# Altium project BEE-1012 PAY-EXP_V110.PrjPcb (part 4 of 7)

## Sheet 11_MCU.SchDoc
size 420 x 297 mm; SheetNumber: 20; SheetTotal: 36
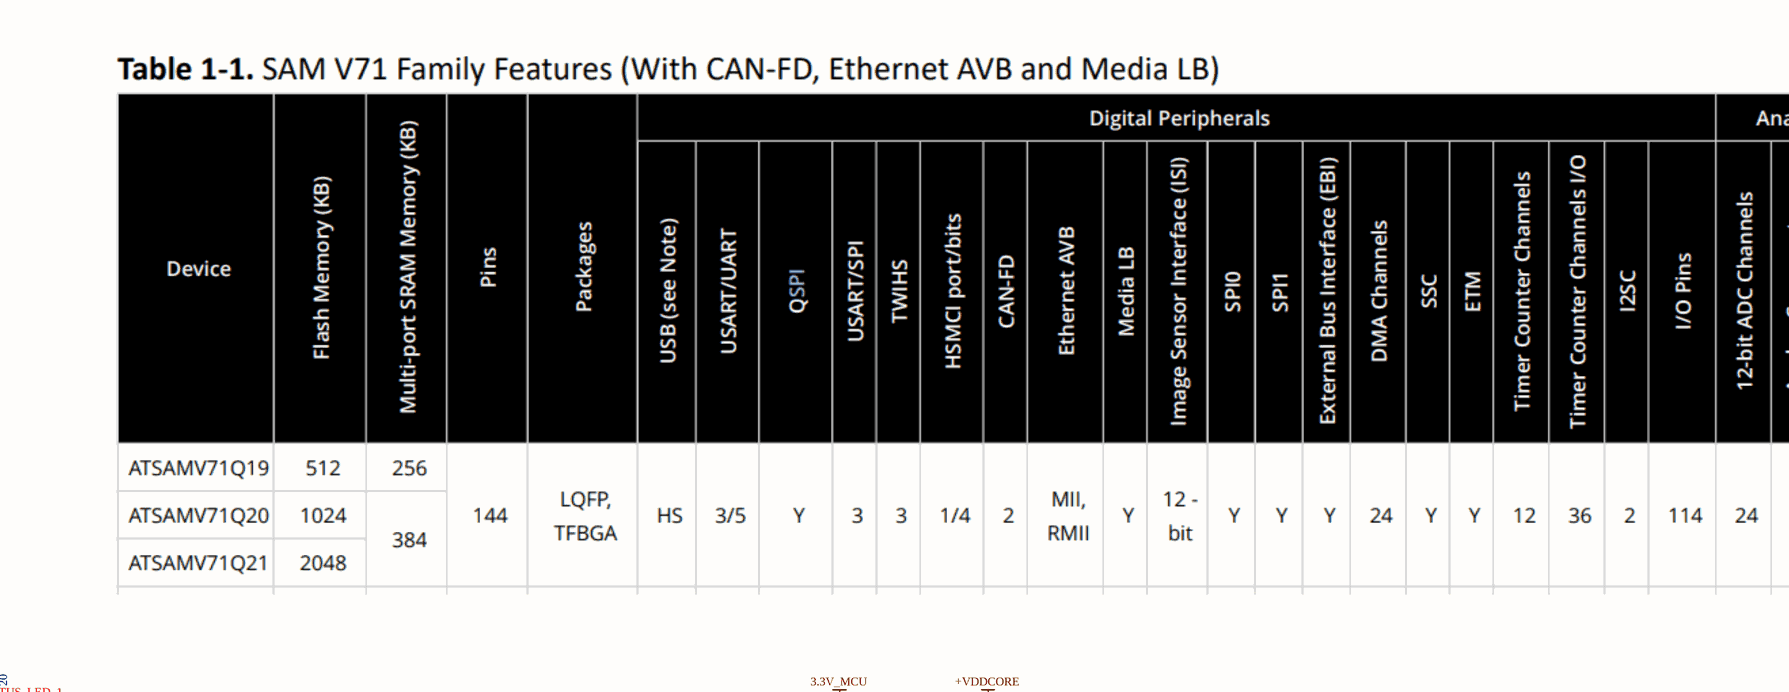
[diagram p18: 11_MCU.SchDoc, top left]
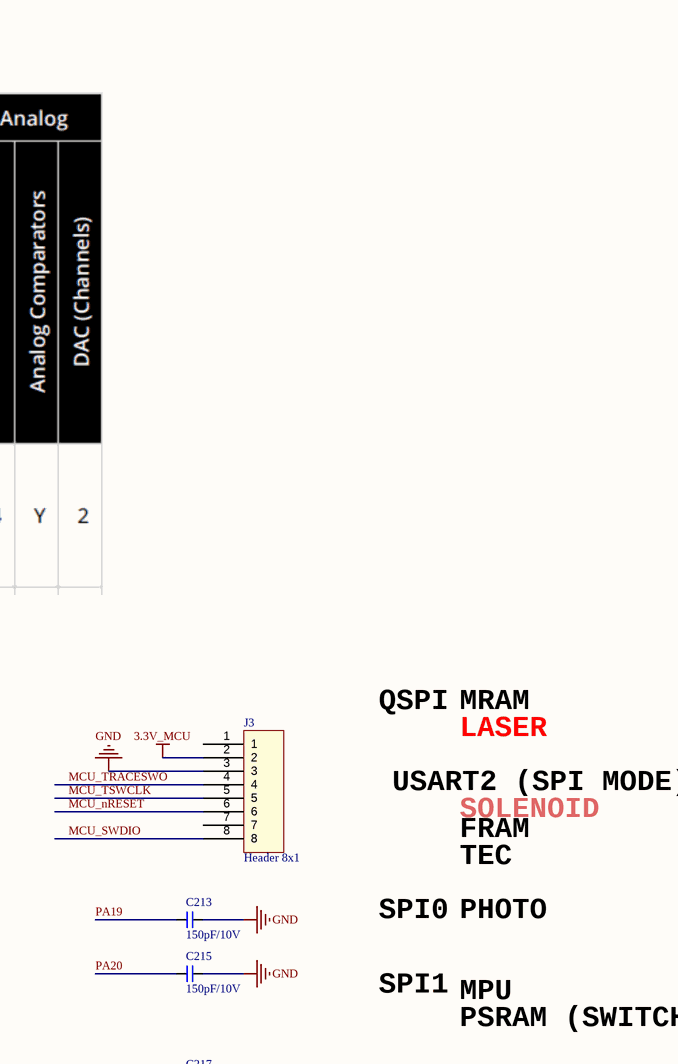
[diagram p19: 11_MCU.SchDoc, top right]
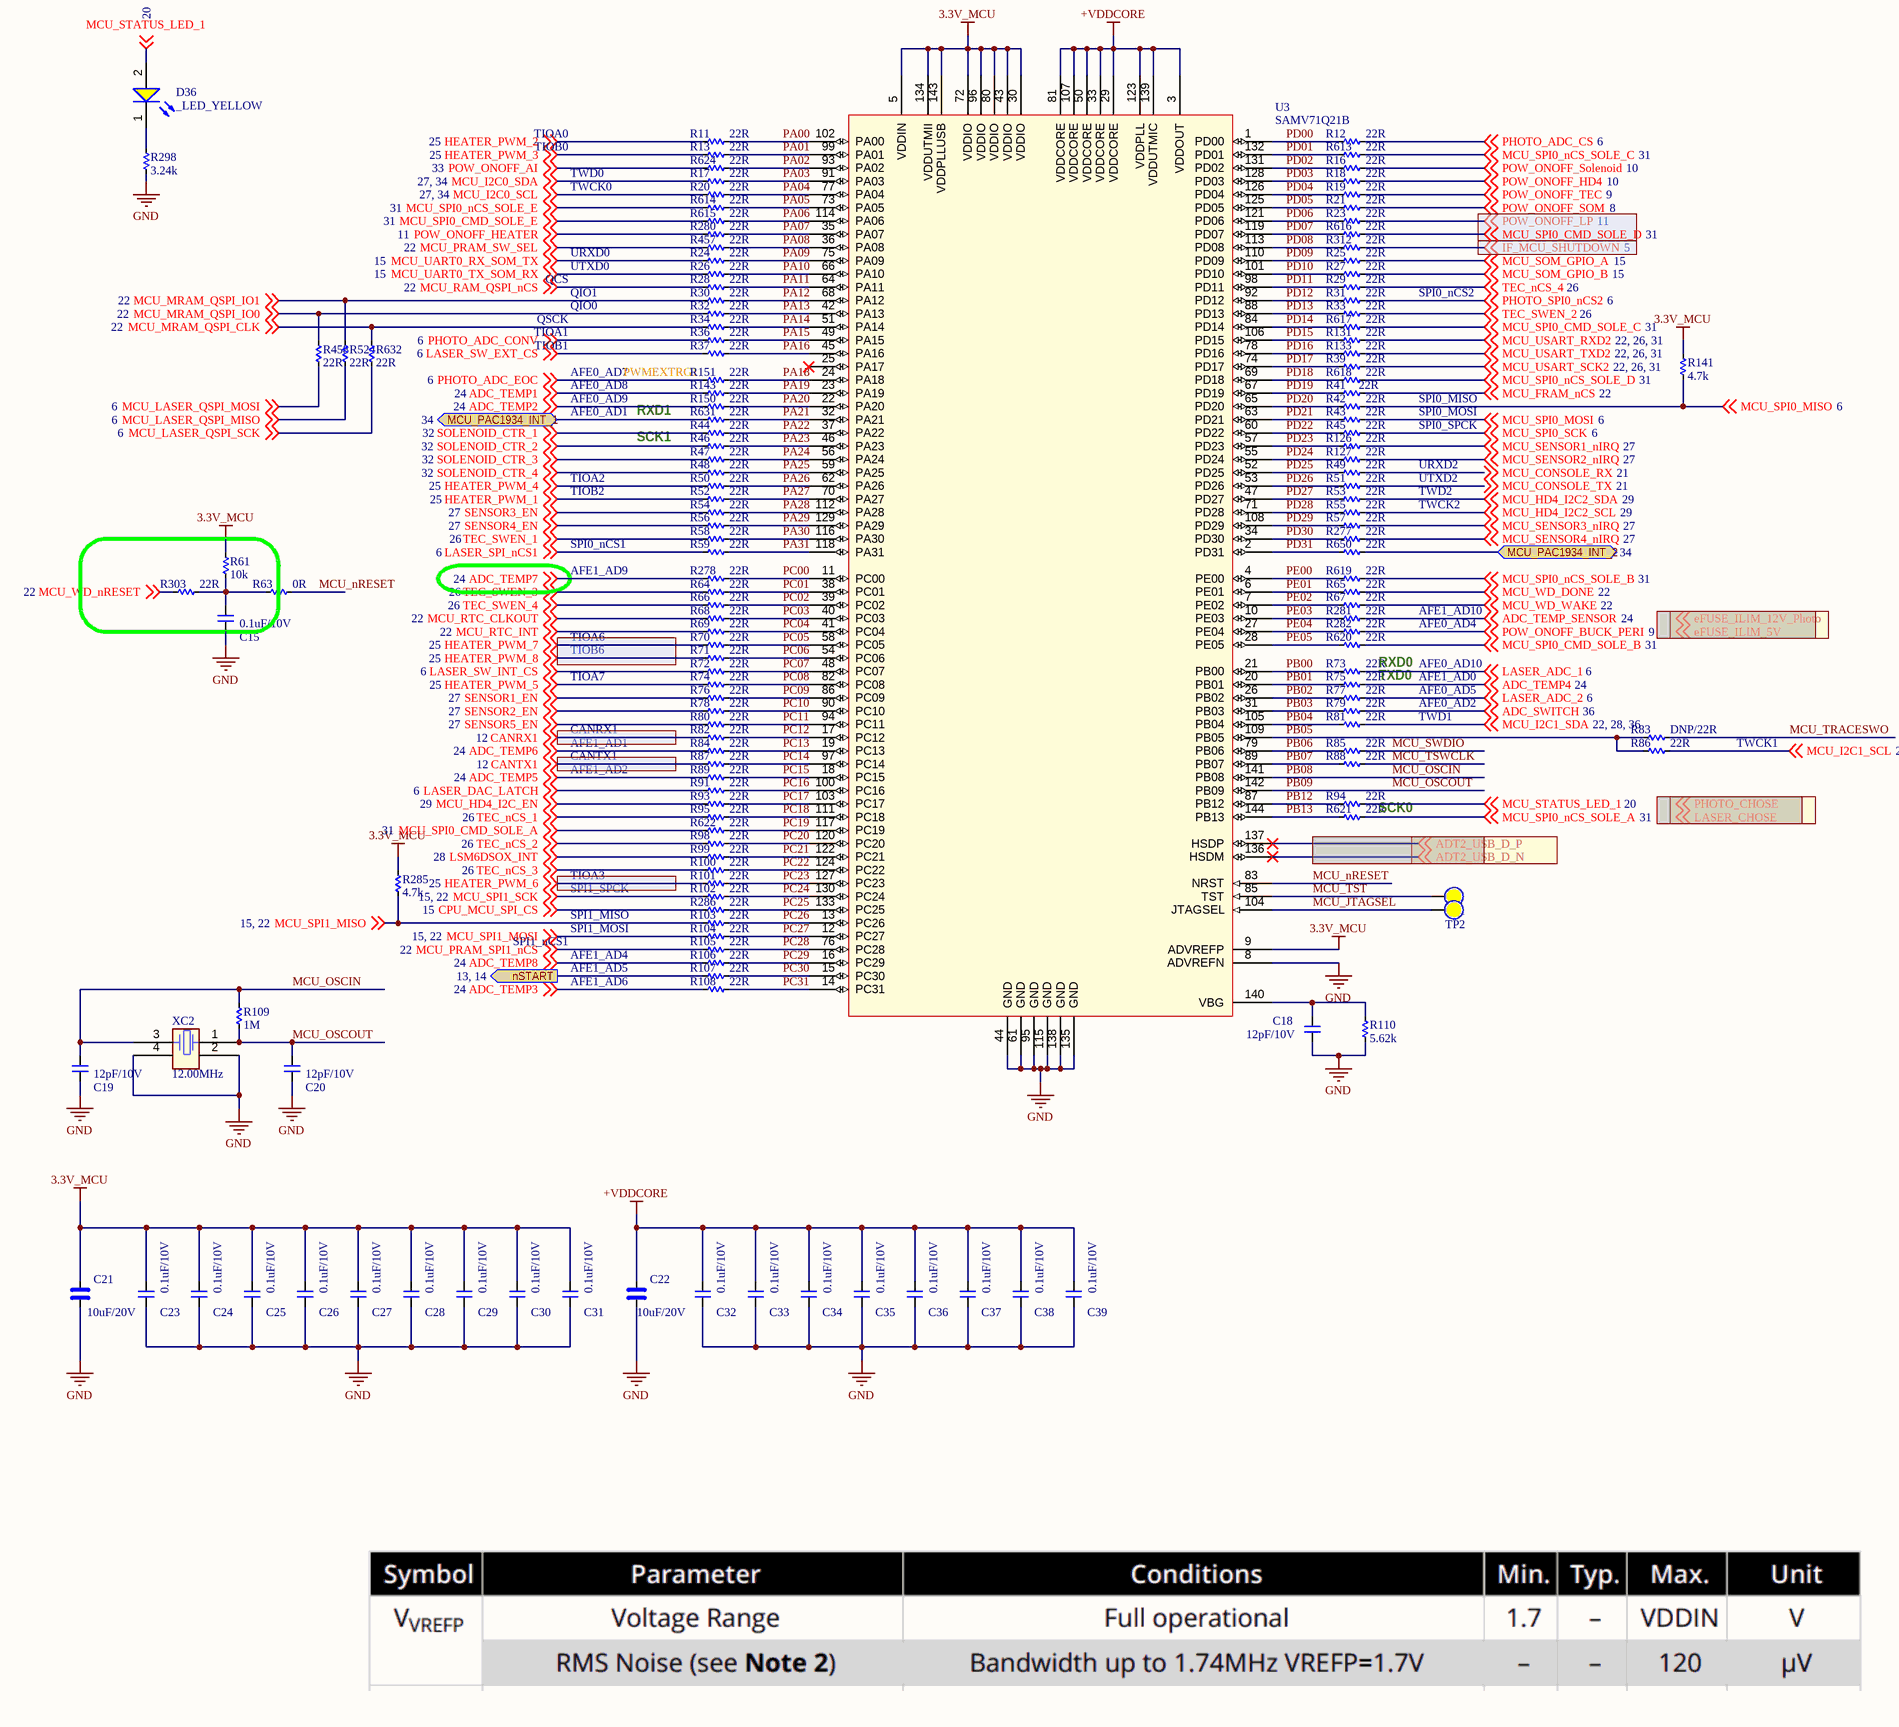
[diagram p20: 11_MCU.SchDoc, bottom left]
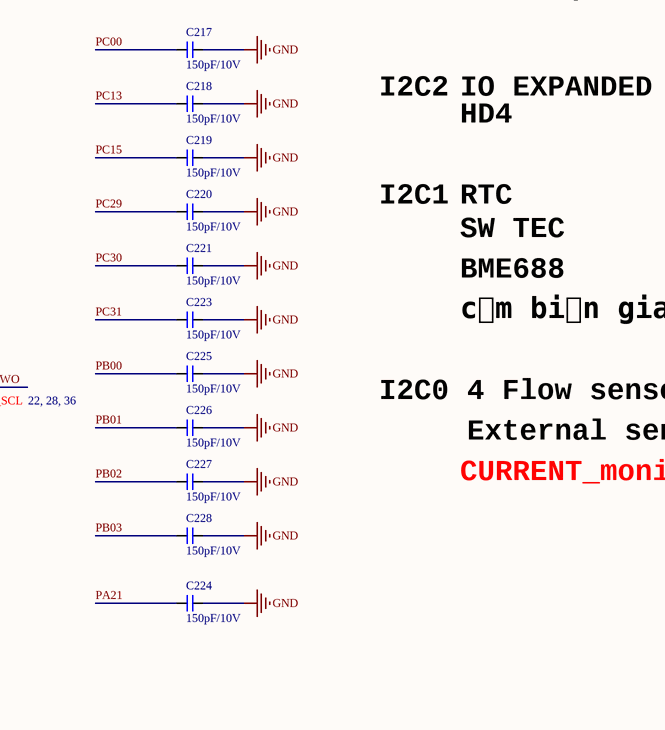
[diagram p21: 11_MCU.SchDoc, bottom right]

### Parts
C15  0.1uF/10V  [CAP_C_1005X60]
C18  12pF/10V  [CAP_C_1005X60]
C19  12pF/10V  [CAP_C_1005X60]
C20  12pF/10V  [CAP_C_1005X60]
C21  10uF/20V  [CAP_C_2012X110]
C22  10uF/20V  [CAP_C_2012X110]
C23  0.1uF/10V  [CAP_C_1005X60]
C24  0.1uF/10V  [CAP_C_1005X60]
C25  0.1uF/10V  [CAP_C_1005X60]
C26  0.1uF/10V  [CAP_C_1005X60]
C27  0.1uF/10V  [CAP_C_1005X60]
C28  0.1uF/10V  [CAP_C_1005X60]
C29  0.1uF/10V  [CAP_C_1005X60]
C30  0.1uF/10V  [CAP_C_1005X60]
C31  0.1uF/10V  [CAP_C_1005X60]
C32  0.1uF/10V  [CAP_C_1005X60]
C33  0.1uF/10V  [CAP_C_1005X60]
C34  0.1uF/10V  [CAP_C_1005X60]
C35  0.1uF/10V  [CAP_C_1005X60]
C36  0.1uF/10V  [CAP_C_1005X60]
C37  0.1uF/10V  [CAP_C_1005X60]
C38  0.1uF/10V  [CAP_C_1005X60]
C39  0.1uF/10V  [CAP_C_1005X60]
C213  150pF/10V  [CAP_C_1005X60]
C215  150pF/10V  [CAP_C_1005X60]
C217  150pF/10V  [CAP_C_1005X60]
C218  150pF/10V  [CAP_C_1005X60]
C219  150pF/10V  [CAP_C_1005X60]
C220  150pF/10V  [CAP_C_1005X60]
C221  150pF/10V  [CAP_C_1005X60]
C223  150pF/10V  [CAP_C_1005X60]
C224  150pF/10V  [CAP_C_1005X60]
C225  150pF/10V  [CAP_C_1005X60]
C226  150pF/10V  [CAP_C_1005X60]
C227  150pF/10V  [CAP_C_1005X60]
C228  150pF/10V  [CAP_C_1005X60]
D36  _LED_YELLOW  [LED_0603]
J3  Header 8x1  [Header_254P_8x1]
R11  22R  [RES_C_1005X40]
R12  22R  [RES_C_1005X40]
R13  22R  [RES_C_1005X40]
R16  22R  [RES_C_1005X40]
R17  22R  [RES_C_1005X40]
R18  22R  [RES_C_1005X40]
R19  22R  [RES_C_1005X40]
R20  22R  [RES_C_1005X40]
R21  22R  [RES_C_1005X40]
R23  22R  [RES_C_1005X40]
R24  22R  [RES_C_1005X40]
R25  22R  [RES_C_1005X40]
R26  22R  [RES_C_1005X40]
R27  22R  [RES_C_1005X40]
R28  22R  [RES_C_1005X40]
R29  22R  [RES_C_1005X40]
R30  22R  [RES_C_1005X40]
R31  22R  [RES_C_1005X40]
R32  22R  [RES_C_1005X40]
R33  22R  [RES_C_1005X40]
R34  22R  [RES_C_1005X40]
R36  22R  [RES_C_1005X40]
R37  22R  [RES_C_1005X40]
R39  22R  [RES_C_1005X40]
R41  22R  [RES_C_1005X40]
R42  22R  [RES_C_1005X40]
R43  22R  [RES_C_1005X40]
R44  22R  [RES_C_1005X40]
R45  22R  [RES_C_1005X40]
R46  22R  [RES_C_1005X40]
R47  22R  [RES_C_1005X40]
R48  22R  [RES_C_1005X40]
R49  22R  [RES_C_1005X40]
R50  22R  [RES_C_1005X40]
R51  22R  [RES_C_1005X40]
R52  22R  [RES_C_1005X40]
R53  22R  [RES_C_1005X40]
R54  22R  [RES_C_1005X40]
R55  22R  [RES_C_1005X40]
R56  22R  [RES_C_1005X40]
R57  22R  [RES_C_1005X40]
R58  22R  [RES_C_1005X40]
R59  22R  [RES_C_1005X40]
R61  10k  [RES_C_1005X40]
R63  0R  [RES_C_1005X40]
R64  22R  [RES_C_1005X40]
R65  22R  [RES_C_1005X40]
R66  22R  [RES_C_1005X40]
R67  22R  [RES_C_1005X40]
R68  22R  [RES_C_1005X40]
R69  22R  [RES_C_1005X40]
R70  22R  [RES_C_1005X40]
R71  22R  [RES_C_1005X40]
R72  22R  [RES_C_1005X40]
R73  22R  [RES_C_1005X40]
R74  22R  [RES_C_1005X40]
R75  22R  [RES_C_1005X40]
R76  22R  [RES_C_1005X40]
R77  22R  [RES_C_1005X40]
R78  22R  [RES_C_1005X40]
R79  22R  [RES_C_1005X40]
R80  22R  [RES_C_1005X40]
R81  22R  [RES_C_1005X40]
R82  22R  [RES_C_1005X40]
R83  DNP/22R  [RES_C_1005X40]
R84  22R  [RES_C_1005X40]
R85  22R  [RES_C_1005X40]
R86  22R  [RES_C_1005X40]
R87  22R  [RES_C_1005X40]
R88  22R  [RES_C_1005X40]
R89  22R  [RES_C_1005X40]
R91  22R  [RES_C_1005X40]
R93  22R  [RES_C_1005X40]
R94  22R  [RES_C_1005X40]
R95  22R  [RES_C_1005X40]
R98  22R  [RES_C_1005X40]
R99  22R  [RES_C_1005X40]
R100  22R  [RES_C_1005X40]
R101  22R  [RES_C_1005X40]
R102  22R  [RES_C_1005X40]
R103  22R  [RES_C_1005X40]
R104  22R  [RES_C_1005X40]
R105  22R  [RES_C_1005X40]
R106  22R  [RES_C_1005X40]
R107  22R  [RES_C_1005X40]
R108  22R  [RES_C_1005X40]
R109  1M  [RES_C_1005X40]
R110  5.62k  [RES_C_1005X40]
R126  22R  [RES_C_1005X40]
R127  22R  [RES_C_1005X40]
R131  22R  [RES_C_1005X40]
R133  22R  [RES_C_1005X40]
R141  4.7k  [RES_C_1005X40]
R143  22R  [RES_C_1005X40]
R150  22R  [RES_C_1005X40]
R151  22R  [RES_C_1005X40]
R277  22R  [RES_C_1005X40]
R278  22R  [RES_C_1005X40]
R280  22R  [RES_C_1005X40]
R281  22R  [RES_C_1005X40]
R282  22R  [RES_C_1005X40]
R285  4.7k  [RES_C_1005X40]
R286  22R  [RES_C_1005X40]
R298  3.24k  [RES_C_1005X40]
R303  22R  [RES_C_1005X40]
R312  22R  [RES_C_1005X40]
R457  22R  [RES_C_1005X40]
R458  22R  [RES_C_1005X40]
R524  22R  [RES_C_1005X40]
R613  22R  [RES_C_1005X40]
R614  22R  [RES_C_1005X40]
R615  22R  [RES_C_1005X40]
R616  22R  [RES_C_1005X40]
R617  22R  [RES_C_1005X40]
R618  22R  [RES_C_1005X40]
R619  22R  [RES_C_1005X40]
R620  22R  [RES_C_1005X40]
R621  22R  [RES_C_1005X40]
R622  22R  [RES_C_1005X40]
R624  22R  [RES_C_1005X40]
R631  22R  [RES_C_1005X40]
R632  22R  [RES_C_1005X40]
R650  22R  [RES_C_1005X40]
TP1  (no value)  [Testpoint_80]  (no BOM)
TP2  (no value)  [Testpoint_80]  (no BOM)
U3  SAMV71Q21B  [AP6-00118]
XC2  value 12.00MHz  [AP7-00039]  (hidden comment: FC5BQCCMC12.0-T1)

### Ports
MCU_PAC1934_INT_1 (bidir, see 34), MCU_PAC1934_INT_2 (bidir, see 34), nSTART (out, see 13, 14)

### Nets
3.3V_MCU: C21.1 C23.2 C24.2 C25.2 C26.2 C27.2 C28.2 C29.2 C30.2 C31.2 J3.2 R61.2 R141.1 R285.1 U3.5(VDDIN) U3.9(ADVREFP) U3.30(VDDIO) U3.43(VDDIO) U3.72(VDDIO) U3.80(VDDIO) U3.96(VDDIO) U3.134(VDDUTMII) U3.143(VDDPLLUSB)
+VDDCORE: C22.1 C32.2 C33.2 C34.2 C35.2 C36.2 C37.2 C38.2 C39.2 U3.3(VDDOUT) U3.29(VDDCORE) U3.33(VDDCORE) U3.50(VDDCORE) U3.81(VDDCORE) U3.107(VDDCORE) U3.123(VDDPLL) U3.139(VDDUTMIC)
GND: C15.1 C18.1 C19.1 C20.1 C21.2 C22.2 C23.1 C24.1 C25.1 C26.1 C27.1 C28.1 C29.1 C30.1 C31.1 C32.1 C33.1 C34.1 C35.1 C36.1 C37.1 C38.1 C39.1 C213.1 C215.1 C217.1 C218.1 C219.1 C220.1 C221.1 C223.1 C224.1 C225.1 C226.1 C227.1 C228.1 J3.3 R110.1 R298.2 U3.8(ADVREFN) U3.44(GND) U3.61(GND) U3.95(GND) U3.115(GND) U3.135(GND) U3.138(GND) XC2.2 XC2.4
ADC_SWITCH: R79.1 ; off-sheet ADC_SWITCH
ADC_TEMP1: R143.2 ; off-sheet ADC_TEMP1
ADC_TEMP2: R150.2 ; off-sheet ADC_TEMP2
ADC_TEMP3: R108.2 ; off-sheet ADC_TEMP3
ADC_TEMP4: R75.1 ; off-sheet ADC_TEMP4
ADC_TEMP5: R89.2 ; off-sheet ADC_TEMP5
ADC_TEMP6: R84.2 ; off-sheet ADC_TEMP6
ADC_TEMP7: R278.2 ; off-sheet ADC_TEMP7
ADC_TEMP8: R106.2 ; off-sheet ADC_TEMP8
ADC_TEMP_SENSOR: R281.1 ; off-sheet ADC_TEMP_SENSOR  [project net TEMP _SENSOR]
CANRX1: R82.2 ; off-sheet CANRX1
CANTX1: R87.2 ; off-sheet CANTX1
CPU_MCU_SPI_CS: R286.2 ; off-sheet CPU_MCU_SPI_CS
HEATER_PWM_1: R52.2 ; off-sheet HEATER_PWM_1
HEATER_PWM_2: R11.2 ; off-sheet HEATER_PWM_2
HEATER_PWM_3: R13.2 ; off-sheet HEATER_PWM_3
HEATER_PWM_4: R50.2 ; off-sheet HEATER_PWM_4
HEATER_PWM_5: R74.2 ; off-sheet HEATER_PWM_5
HEATER_PWM_6: R101.2 ; off-sheet HEATER_PWM_6
HEATER_PWM_7: R70.2 ; off-sheet HEATER_PWM_7
HEATER_PWM_8: R71.2 ; off-sheet HEATER_PWM_8
IF_MCU_SHUTDOWN: R312.1 ; off-sheet IF_MCU_SHUTDOWN
LASER_ADC_1: R73.1 ; off-sheet LASER_ADC_1
LASER_ADC_2: R77.1 ; off-sheet LASER_ADC_2
LASER_DAC_LATCH: R91.2 ; off-sheet LASER_DAC_LATCH
LASER_SPI_nCS1: R59.2 ; off-sheet LASER_SPI_nCS1
LASER_SW_EXT_CS: R37.2 ; off-sheet LASER_SW_EXT_CS
LASER_SW_INT_CS: R72.2 ; off-sheet LASER_SW_INT_CS
LSM6DSOX_INT: R99.2 ; off-sheet LSM6DSOX_INT
MCU_CONSOLE_RX: R49.1 ; off-sheet MCU_CONSOLE_RX
MCU_CONSOLE_TX: R51.1 ; off-sheet MCU_CONSOLE_TX
MCU_FRAM_nCS: R41.2 ; off-sheet MCU_FRAM_nCS
MCU_HD4_I2C2_SCL: R55.1 ; off-sheet MCU_HD4_I2C2_SCL
MCU_HD4_I2C2_SDA: R53.1 ; off-sheet MCU_HD4_I2C2_SDA
MCU_HD4_I2C_EN: R93.2 ; off-sheet MCU_HD4_I2C_EN
MCU_I2C0_SCL: R20.2 ; off-sheet MCU_I2C0_SCL
MCU_I2C0_SDA: R17.2 ; off-sheet MCU_I2C0_SDA
MCU_I2C1_SCL: R86.1 ; off-sheet MCU_I2C1_SCL
MCU_I2C1_SDA: R81.1 ; off-sheet MCU_I2C1_SDA
MCU_JTAGSEL: TP2.1 U3.104(JTAGSEL)
MCU_LASER_QSPI_MISO: R524.2 ; off-sheet MCU_LASER_QSPI_MISO
MCU_LASER_QSPI_MOSI: R458.2 ; off-sheet MCU_LASER_QSPI_MOSI
MCU_LASER_QSPI_SCK: R632.2 ; off-sheet MCU_LASER_QSPI_SCK
MCU_MRAM_QSPI_CLK: R34.2 R632.1 ; off-sheet MCU_MRAM_QSPI_CLK
MCU_MRAM_QSPI_IO0: R32.2 R458.1 ; off-sheet MCU_MRAM_QSPI_IO0
MCU_MRAM_QSPI_IO1: R30.2 R524.1 ; off-sheet MCU_MRAM_QSPI_IO1
MCU_nRESET: J3.6 R63.1 U3.83(NRST)
MCU_OSCIN: C19.2 R109.2 U3.141(PB08) XC2.3  [also labelled PB08]
MCU_OSCOUT: C20.2 R109.1 U3.142(PB09) XC2.1  [also labelled PB09]
MCU_PRAM_SPI1_nCS: R105.2 ; off-sheet MCU_PRAM_SPI1_nCS
MCU_PRAM_SW_SEL: R457.2 ; off-sheet MCU_PRAM_SW_SEL
MCU_RAM_QSPI_nCS: R28.2 ; off-sheet MCU_RAM_QSPI_nCS
MCU_RTC_CLKOUT: R68.2 ; off-sheet MCU_RTC_CLKOUT
MCU_RTC_INT: R69.2 ; off-sheet MCU_RTC_INT
MCU_SENSOR1_nIRQ: R126.1 ; off-sheet MCU_SENSOR1_nIRQ
MCU_SENSOR2_nIRQ: R127.1 ; off-sheet MCU_SENSOR2_nIRQ
MCU_SENSOR3_nIRQ: R57.2 ; off-sheet MCU_SENSOR3_nIRQ
MCU_SENSOR4_nIRQ: R277.2 ; off-sheet MCU_SENSOR4_nIRQ
MCU_SOM_GPIO_A: R25.1 ; off-sheet MCU_SOM_GPIO_A
MCU_SOM_GPIO_B: R27.1 ; off-sheet MCU_SOM_GPIO_B
MCU_SPI0_CMD_SOLE_A: R622.2 ; off-sheet MCU_SPI0_CMD_SOLE_A
MCU_SPI0_CMD_SOLE_B: R620.1 ; off-sheet MCU_SPI0_CMD_SOLE_B
MCU_SPI0_CMD_SOLE_C: R617.1 ; off-sheet MCU_SPI0_CMD_SOLE_C
MCU_SPI0_CMD_SOLE_D: R616.1 ; off-sheet MCU_SPI0_CMD_SOLE_D
MCU_SPI0_CMD_SOLE_E: R615.2 ; off-sheet MCU_SPI0_CMD_SOLE_E
MCU_SPI0_MISO: R42.1 R141.2 ; off-sheet MCU_SPI0_MISO
MCU_SPI0_MOSI: R43.1 ; off-sheet MCU_SPI0_MOSI
MCU_SPI0_nCS_SOLE_A: R621.1 ; off-sheet MCU_SPI0_nCS_SOLE_A
MCU_SPI0_nCS_SOLE_B: R619.1 ; off-sheet MCU_SPI0_nCS_SOLE_B
MCU_SPI0_nCS_SOLE_C: R613.1 ; off-sheet MCU_SPI0_nCS_SOLE_C
MCU_SPI0_nCS_SOLE_D: R618.1 ; off-sheet MCU_SPI0_nCS_SOLE_D
MCU_SPI0_nCS_SOLE_E: R614.2 ; off-sheet MCU_SPI0_nCS_SOLE_E
MCU_SPI0_SCK: R45.1 ; off-sheet MCU_SPI0_SCK
MCU_SPI1_MISO: R103.2 R285.2 ; off-sheet MCU_SPI1_MISO
MCU_SPI1_MOSI: R104.2 ; off-sheet MCU_SPI1_MOSI
MCU_SPI1_SCK: R102.2 ; off-sheet MCU_SPI1_SCK
MCU_STATUS_LED_1: D36.2(A) R94.1 ; off-sheet MCU_STATUS_LED_1
MCU_SWDIO: J3.8 R85.1
MCU_TRACESWO: J3.4 R83.1
MCU_TST: TP1.1 U3.85(TST)
MCU_TSWCLK: J3.5 R88.1
MCU_UART0_RX_SOM_TX: R24.2 ; off-sheet MCU_UART0_RX_SOM_TX
MCU_UART0_TX_SOM_RX: R26.2 ; off-sheet MCU_UART0_TX_SOM_RX
MCU_USART_RXD2: R131.1 ; off-sheet MCU_USART_RXD2
MCU_USART_SCK2: R39.1 ; off-sheet MCU_USART_SCK2
MCU_USART_TXD2: R133.1 ; off-sheet MCU_USART_TXD2
MCU_WD_DONE: R65.1 ; off-sheet MCU_WD_DONE
MCU_WD_nRESET: R303.2 ; off-sheet MCU_WD_nRESET
MCU_WD_WAKE: R67.1 ; off-sheet MCU_WD_WAKE
PA00: R11.1 U3.102(PA00)
PA01: R13.1 U3.99(PA01)
PA02: R624.1 U3.93(PA02)
PA03: R17.1 U3.91(PA03)
PA04: R20.1 U3.77(PA04)
PA05: R614.1 U3.73(PA05)
PA06: R615.1 U3.114(PA06)
PA07: R280.1 U3.35(PA07)
PA08: R457.1 U3.36(PA08)
PA09: R24.1 U3.75(PA09)
PA10: R26.1 U3.66(PA10)
PA11: R28.1 U3.64(PA11)
PA12: R30.1 U3.68(PA12)
PA13: R32.1 U3.42(PA13)
PA14: R34.1 U3.51(PA14)
PA15: R36.1 U3.49(PA15)
PA16: R37.1 U3.45(PA16)
PA18: R151.1 U3.24(PA18)
PA19: C213.2 R143.1 U3.23(PA19)
PA20: C215.2 R150.1 U3.22(PA20)
PA21: C224.2 R631.1 U3.32(PA21)
PA22: R44.1 U3.37(PA22)
PA23: R46.1 U3.46(PA23)
PA24: R47.1 U3.56(PA24)
PA25: R48.1 U3.59(PA25)
PA26: R50.1 U3.62(PA26)
PA27: R52.1 U3.70(PA27)
PA28: R54.1 U3.112(PA28)
PA29: R56.1 U3.129(PA29)
PA30: R58.1 U3.116(PA30)
PA31: R59.1 U3.118(PA31)
PB00: C225.2 R73.2 U3.21(PB00)
PB01: C226.2 R75.2 U3.20(PB01)
PB02: C227.2 R77.2 U3.26(PB02)
PB03: C228.2 R79.2 U3.31(PB03)
PB04: R81.2 U3.105(PB04)
PB05: R83.2 R86.2 U3.109(PB05)
PB06: R85.2 U3.79(PB06)
PB07: R88.2 U3.89(PB07)
PB12: R94.2 U3.87(PB12)
PB13: R621.2 U3.144(PB13)
PC00: C217.2 R278.1 U3.11(PC00)
PC01: R64.1 U3.38(PC01)
PC02: R66.1 U3.39(PC02)
PC03: R68.1 U3.40(PC03)
PC04: R69.1 U3.41(PC04)
PC05: R70.1 U3.58(PC05)
PC06: R71.1 U3.54(PC06)
PC07: R72.1 U3.48(PC07)
PC08: R74.1 U3.82(PC08)
PC09: R76.1 U3.86(PC09)
PC10: R78.1 U3.90(PC10)
PC11: R80.1 U3.94(PC11)
PC12: R82.1 U3.17(PC12)
PC13: C218.2 R84.1 U3.19(PC13)
PC14: R87.1 U3.97(PC14)
PC15: C219.2 R89.1 U3.18(PC15)
PC16: R91.1 U3.100(PC16)
PC17: R93.1 U3.103(PC17)
PC18: R95.1 U3.111(PC18)
PC19: R622.1 U3.117(PC19)
PC20: R98.1 U3.120(PC20)
PC21: R99.1 U3.122(PC21)
PC22: R100.1 U3.124(PC22)
PC23: R101.1 U3.127(PC23)
PC24: R102.1 U3.130(PC24)
PC25: R286.1 U3.133(PC25)
PC26: R103.1 U3.13(PC26)
PC27: R104.1 U3.12(PC27)
PC28: R105.1 U3.76(PC28)
PC29: C220.2 R106.1 U3.16(PC29)
PC30: C221.2 R107.1 U3.15(PC30)
PC31: C223.2 R108.1 U3.14(PC31)
PD00: R12.2 U3.1(PD00)
PD01: R613.2 U3.132(PD01)
PD02: R16.2 U3.131(PD02)
PD03: R18.2 U3.128(PD03)
PD04: R19.2 U3.126(PD04)
PD05: R21.2 U3.125(PD05)
PD06: R23.2 U3.121(PD06)
PD07: R616.2 U3.119(PD07)
PD08: R312.2 U3.113(PD08)
PD09: R25.2 U3.110(PD09)
PD10: R27.2 U3.101(PD10)
PD11: R29.2 U3.98(PD11)
PD12: R31.2 U3.92(PD12)
PD13: R33.2 U3.88(PD13)
PD14: R617.2 U3.84(PD14)
PD15: R131.2 U3.106(PD15)
PD16: R133.2 U3.78(PD16)
PD17: R39.2 U3.74(PD17)
PD18: R618.2 U3.69(PD18)
PD19: R41.1 U3.67(PD19)
PD20: R42.2 U3.65(PD20)
PD21: R43.2 U3.63(PD21)
PD22: R45.2 U3.60(PD22)
PD23: R126.2 U3.57(PD23)
PD24: R127.2 U3.55(PD24)
PD25: R49.2 U3.52(PD25)
PD26: R51.2 U3.53(PD26)
PD27: R53.2 U3.47(PD27)
PD28: R55.2 U3.71(PD28)
PD29: R57.1 U3.108(PD29)
PD30: R277.1 U3.34(PD30)
PD31: R650.1 U3.2(PD31)
PE00: R619.2 U3.4(PE00)
PE01: R65.2 U3.6(PE01)
PE02: R67.2 U3.7(PE02)
PE03: R281.2 U3.10(PE03)
PE04: R282.2 U3.27(PE04)
PE05: R620.2 U3.28(PE05)
PHOTO_ADC_CONV: R36.2 ; off-sheet PHOTO_ADC_CONV
PHOTO_ADC_CS: R12.1 ; off-sheet PHOTO_ADC_CS
PHOTO_ADC_EOC: R151.2 ; off-sheet PHOTO_ADC_EOC
PHOTO_SPI0_nCS2: R31.1 ; off-sheet PHOTO_SPI0_nCS2
POW_ONOFF_AI: R624.2 ; off-sheet POW_ONOFF_AI
POW_ONOFF_BUCK_PERI: R282.1 ; off-sheet POW_ONOFF_BUCK_PERI
POW_ONOFF_HD4: R18.1 ; off-sheet POW_ONOFF_HD4
POW_ONOFF_HEATER: R280.2 ; off-sheet POW_ONOFF_HEATER
POW_ONOFF_LP: R23.1 ; off-sheet POW_ONOFF_LP
POW_ONOFF_Solenoid: R16.1 ; off-sheet POW_ONOFF_Solenoid
POW_ONOFF_SOM: R21.1 ; off-sheet POW_ONOFF_SOM
POW_ONOFF_TEC: R19.1 ; off-sheet POW_ONOFF_TEC
SENSOR1_EN: R76.2 ; off-sheet SENSOR1_EN
SENSOR2_EN: R78.2 ; off-sheet SENSOR2_EN
SENSOR3_EN: R54.2 ; off-sheet SENSOR3_EN
SENSOR4_EN: R56.2 ; off-sheet SENSOR4_EN
SENSOR5_EN: R80.2 ; off-sheet SENSOR5_EN
SOLENOID_CTR_1: R44.2 ; off-sheet SOLENOID_CTR_1
SOLENOID_CTR_2: R46.2 ; off-sheet SOLENOID_CTR_2
SOLENOID_CTR_3: R47.2 ; off-sheet SOLENOID_CTR_3
SOLENOID_CTR_4: R48.2 ; off-sheet SOLENOID_CTR_4
TEC_nCS_1: R95.2 ; off-sheet TEC_nCS_1
TEC_nCS_2: R98.2 ; off-sheet TEC_nCS_2
TEC_nCS_3: R100.2 ; off-sheet TEC_nCS_3
TEC_nCS_4: R29.1 ; off-sheet TEC_nCS_4
TEC_SWEN_1: R58.2 ; off-sheet TEC_SWEN_1
TEC_SWEN_2: R33.1 ; off-sheet TEC_SWEN_2
TEC_SWEN_3: R64.2 ; off-sheet TEC_SWEN_3
TEC_SWEN_4: R66.2 ; off-sheet TEC_SWEN_4
NetC15_2: C15.2 R61.1 R63.2 R303.1
NetC18_2: C18.2 R110.2 U3.140(VBG)
NetC355_1: R107.2 ; port nSTART
NetD36_1: D36.1(K) R298.1
NetR558#1_2: R631.2 ; port MCU_PAC1934_INT_1
NetR562#1_2: R650.2 ; port MCU_PAC1934_INT_2

Not connected (* = marked no-connect by the designer): J3 1 7; U3 25(PA17)* 136(HSDM)* 137(HSDP)*

### Notes on the sheet
- QSPI
- LASER
- MRAM
- TIOA0
- USART2 (SPI MODE)
- TWD0
- TWCK0
- TIOB0
- TEC
- FRAM
- SOLENOID
- URXD0
- UTXD0
- SPI0
- PHOTO
- QIO1
- QCS
- QSCK
- QIO0
- TIOA1
- SPI0_nCS2
- SPI1
- MPU
- AFE0_AD8
- AFE0_AD9
- AFE0_AD7
- TIOB1
- PWMEXTRG1
- SPI0_MISO
- PSRAM (SWITCH SOM)
- AFE0_AD1
- SCK1
- RXD1
- SPI0_MOSI
- SPI0_SPCK
- URXD2
- I2C2
- IO EXPANDED
- TIOA2
- TIOB2
- TWD2
- TWCK2
- UTXD2
- HD4
- SPI0_nCS1
- AFE1_AD9
- I2C1
- RTC
- SW TEC
- TIOA6
- TIOB6
- RXD0
- AFE1_AD10
- AFE0_AD4
- AFE0_AD10
- BME688
- CANRX1
- TIOA7
- TXD0
- AFE0_AD2
- AFE0_AD5
- AFE1_AD0
- TWD1
- cảm biến gia tốc
- AFE1_AD2
- AFE1_AD1
- CANTX1
- TWCK1
- I2C0
- 4 Flow sensor
- External sensor
- SCK0
- CURRENT_monitor
- SPI1_MISO
- SPI1_MOSI
- SPI1_SPCK
- TIOA3
- SPI1_nCS1
- AFE1_AD4
- AFE1_AD5
- AFE1_AD6
- Project:
- Sub-system:
- Design by:
- Sheet title:
- Sheet
- of
- Checked by:
- Approved by:
- Revision:
- Document No:
- Size:
- Date:
- A3

### Library data of the parts
C15 C18-C20 C23-C39 C213 C215 C217-C221 C223-C228 = _CAP_C_2: CAP
C21 C22 = _CAP_C_High_2: CAP High Value
R11-R13 R16-R21 R23-R34 R36 R37 R39 R41-R59 R61 R63-R89 R91 R93-R95 R98-R110 R126 R127 R131 R133 R141 R143 R150 R151 R277 R278 R280-R282 R285 R286 R298 R303 R312 R457 R458 R524 R613-R622 R624 R631 R632 R650 = _RES_B_2: RES
TP1 TP2 = Test Point: Solder: NF
U3 = A06-1541: SAM 32-bit ARM Cortex-M* RISC MCU, SAMV71B Series, QFP144; PartGroup: Integrated Circuits,MCU, MPU, DSP,ARM MCU; Manufacturer: MICROCHIP; MPN: ATSAMV71Q21B-AAB; TemperatureRange: -40Â°C to +105Â°C; AN: A06-1541; Value: SAMV71Q21B; Height: 1,60000002384186
XC2 = A07-0042: Fox FQ5032B 12.0MHz SMD crystal 738B-12; PartGroup: Frequency devices,Crystals,SMD; Manufacturer: Fox  Electronics; MPN: FQ5032B-12.000; Tolerance: Â±30ppm; TemperatureRange: 0Â°C ~ 70Â°C; AN: A07-0042; Height: 1,20000004768372